# Altium schematic sheet aircraft.SchDoc
size A4
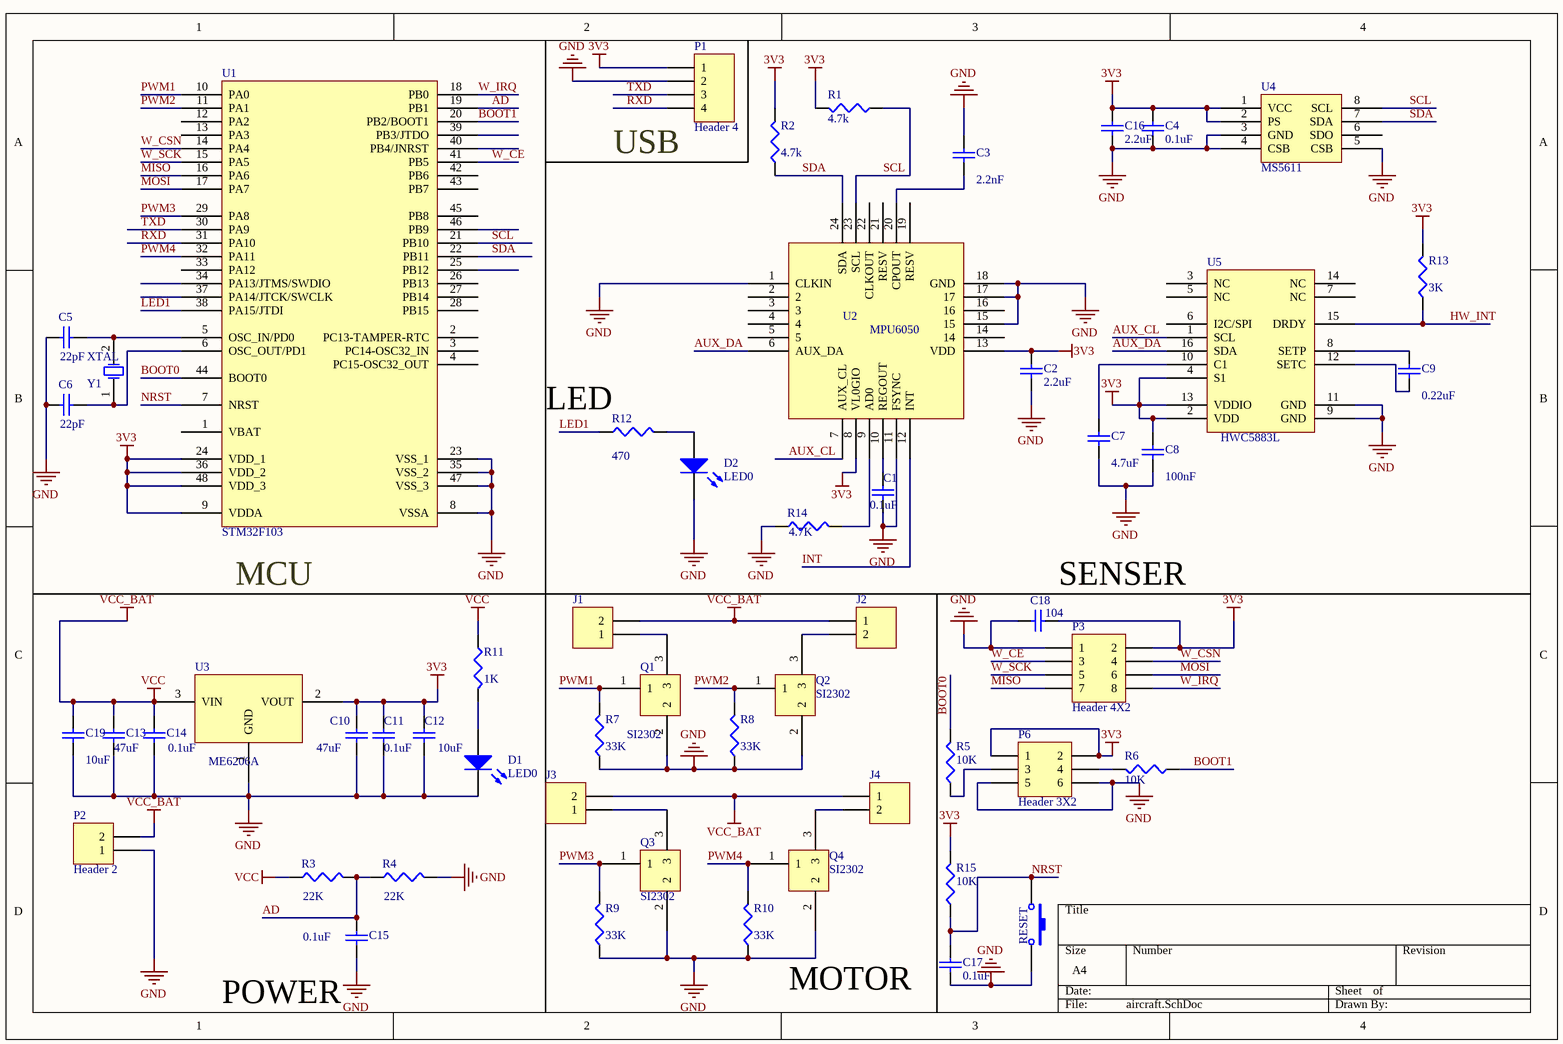
[diagram p0: aircraft.SchDoc]

## Parts
C1  value 0.1uF  [0402]  (hidden comment: Cap)
C2  value 2.2uF  [0402]  (hidden comment: Cap)
C3  value 2.2nF  [0402]  (hidden comment: Cap)
C4  value 0.1uF  [0402]  (hidden comment: Cap)
C5  value 22pF  [0402]  (hidden comment: Cap)
C6  value 22pF  [0402]  (hidden comment: Cap)
C7  value 4.7uF  [0402]  (hidden comment: Cap)
C8  value 100nF  [0402]  (hidden comment: Cap)
C9  value 0.22uF  [0402]  (hidden comment: Cap)
C10  value 47uF  [6-0805_L]  (hidden comment: Cap)
C11  value 0.1uF  [0402]  (hidden comment: Cap)
C12  value 10uF  [1608[0603]]  (hidden comment: Cap)
C13  value 47uF  [6-0805_L]  (hidden comment: Cap)
C14  value 0.1uF  [0402]  (hidden comment: Cap)
C15  value 0.1uF  [0402]  (hidden comment: Cap)
C16  value 2.2uF  [0402]  (hidden comment: Cap)
C17  value 0.1uF  [0402]  (hidden comment: Cap)
C18  value 104  [0402]  (hidden comment: Cap)
C19  value 10uF  [1608[0603]]  (hidden comment: Cap)
D1  LED0  [1608[0603]]
D2  LED0  [1608[0603]]
J1  Header 2  [HDR1X2]  (value not drawn)
J2  Header 2  [HDR1X2]  (value not drawn)
J3  Header 2  [HDR1X2]  (value not drawn)
J4  Header 2  [HDR1X2]  (value not drawn)
P1  Header 4  [HDR1X4]
P2  Header 2  [HDR1X2]
P3  Header 4X2  [HDR2X4]
P6  Header 3X2  [HDR2X3]
Q1  SI2302  [SOT-23_M]
Q2  SI2302  [SOT-23_M]
Q3  SI2302  [SOT-23_M]
Q4  SI2302  [SOT-23_M]
R1  value 4.7k  [0402]  (hidden comment: Res3)
R2  value 4.7k  [0402]  (hidden comment: Res3)
R3  value 22K  [0402]  (hidden comment: Res3)
R4  value 22K  [0402]  (hidden comment: Res3)
R5  value 10K  [0402]  (hidden comment: Res3)
R6  value 10K  [0402]  (hidden comment: Res3)
R7  value 33K  [0402]  (hidden comment: Res3)
R8  value 33K  [0402]  (hidden comment: Res3)
R9  value 33K  [0402]  (hidden comment: Res3)
R10  value 33K  [0402]  (hidden comment: Res3)
R11  value 1K  [0402]  (hidden comment: Res3)
R12  value 470  [0402]  (hidden comment: Res3)
R13  value 3K  [0402]  (hidden comment: Res3)
R14  value 4.7K  [0402]  (hidden comment: Res3)
R15  value 10K  [0402]  (hidden comment: Res3)
RESET  SW-PB  [SW2]  (value not drawn)
U1  STM32F103  [LQFP48S]
U2  MPU6050  [QFN24]
U3  ME6206A  [SOT23_M]
U4  MS5611  [MS5611 - duplicate]
U5  HWC5883L  [HMC5883L]
Y1  XTAL  [XTAL2]

## Nets
3V3: C2.2 C4.2 C8.2 C10.2 C11.1 C12.1 C16.2 C18.2 P1.1 P3.2 P6.1 P6.2 R1.2 R2.2 R13.2 R15.2 U1.9(VDDA) U1.24(VDD_1) U1.36(VDD_2) U1.48(VDD_3) U2.8(VL0GIO) U2.13(VDD) U3.2(VOUT) U4.1(VCC) U4.2(PS) U5.2(VDD) U5.4(S1) U5.13(VDDIO)
GND: C1.1 C2.1 C3.2 C4.1 C5.1 C6.1 C7.1 C8.1 C10.1 C11.2 C12.2 C13.1 C14.1 C15.1 C16.1 C17.2 C18.1 C19.1 D1.2(K) D2.2(K) P1.2 P2.1 P3.1 P6.5 P6.6 Q1.2 Q2.2 Q3.2 Q4.2 R4.2 R7.1 R8.1 R9.1 R10.1 R14.1 RESET.2 U1.8(VSSA) U1.23(VSS_1) U1.35(VSS_2) U1.47(VSS_3) U2.1(CLKIN) U2.11(FSYNC) U2.15 U2.17 U2.18(GND) U3.1(GND) U4.3(GND) U4.4(CSB) U4.5(CSB) U5.9(GND) U5.11(GND)
VCC: C13.2 C14.2 C19.2 J1.2 J2.1 J3.2 J4.1 P2.2 R3.1 R11.1 U3.3(VIN)  [also labelled VCC_BAT]
AD: C15.2 R3.2 R4.1 U1.19(PB1)
AUX_CL: U2.7(AUX_CL) U5.1(SCL)
AUX_DA: U2.6(AUX_DA) U5.16(SDA)
BOOT0: R5.2 U1.44(BOOT0)
BOOT1: R6.1 U1.20(PB2/BOOT1)
HW_INT: R13.1 U5.15(DRDY)
INT: U2.12(INT)
LED1: R12.1 U1.38(PA15/JTDI)
MISO: P3.7 U1.16(PA6)
MOSI: P3.6 U1.17(PA7)
NRST: C17.1 R15.1 RESET.1 U1.7(NRST)
PWM1: Q1.1 R7.2 U1.10(PA0)
PWM2: Q2.1 R8.2 U1.11(PA1)
PWM3: Q3.1 R9.2 U1.29(PA8)
PWM4: Q4.1 R10.2 U1.32(PA11)
RXD: P1.4 U1.31(PA10)
SCL: R1.1 U1.21(PB10) U2.23(SCL) U4.8(SCL)
SDA: R2.1 U1.22(PB11) U2.24(SDA) U4.7(SDA)
TXD: P1.3 U1.30(PA9)
W_CE: P3.3 U1.41(PB5)
W_CSN: P3.4 U1.14(PA4)
W_IRQ: P3.8 U1.18(PB0)
W_SCK: P3.5 U1.15(PA5)
NetC1_2: C1.2 U2.10(REGOUT)
NetC3_1: C3.1 U2.20(CPOUT)
NetC5_2: C5.2 U1.5(OSC_IN/PD0) Y1.2(OSC2)
NetC6_2: C6.2 U1.6(OSC_OUT/PD1) Y1.1(OSC1)
NetC7_2: C7.2 U5.10(C1)
NetC9_1: C9.1 U5.12(SETC)
NetC9_2: C9.2 U5.8(SETP)
NetD1_1: D1.1(A) R11.2
NetD2_1: D2.1(A) R12.2
NetJ1_1: J1.1 Q1.3
NetJ2_2: J2.2 Q2.3
NetJ3_1: J3.1 Q3.3
NetJ4_2: J4.2 Q4.3
NetP6_3: P6.3 R5.1
NetP6_4: P6.4 R6.2
NetR14_2: R14.2 U2.9(AD0)

Not connected (* = marked no-connect by the designer): U1 1(VBAT) 2(PC13-TAMPER-RTC) 3(PC14-OSC32_IN) 4(PC15-OSC32_OUT) 12(PA2) 13(PA3) 25(PB12) 26(PB13) 27(PB14) 28(PB15) 33(PA12) 34(PA13/JTMS/SWDIO) 37(PA14/JTCK/SWCLK) 39(PB3/JTDO) 40(PB4/JNRST) 42(PB6) 43(PB7) 45(PB8) 46(PB9); U2 2 3 4 5 14 16 19(RESV) 21(RESV) 22(CLKOUT); U4 6(SDO); U5 3(NC) 5(NC) 6(I2C/SPI) 7(NC) 14(NC)

## Notes on the sheet
- (near P1) USB
- (near R12) LED
- (near U1) MCU
- (near C18) SENSER
- (near R10) MOTOR
- POWER

## Library data of the parts
C1-C19 = Cap: Capacitor; Published: 8-Jun-2000; LatestRevisionDate: 17-Jul-2002; LatestRevisionNote: Re-released for DXP Platform.; PackageReference: RAD-0.3; Publisher: Altium Limited; PackageDescription: Radial Cap, Thru-Hole; 2 Leads; 0.3 in Pin Spacing
D1 D2 = LED0: Typical INFRARED GaAs LED; Published: 8-Jun-2000; LatestRevisionDate: 08-Jul-2005; LatestRevisionNote: Mech Layer 1 removed.; PackageReference: LED-0; Publisher: Altium Limited; PackageDescription: LED; 2 Leads
J1-J4 P2 = Header 2: Header, 2-Pin; LatestRevisionDate: 17-Jul-2002; LatestRevisionNote: Re-released for DXP Platform.; Publisher: Altium Limited
P1 = Header 4: Header, 4-Pin; LatestRevisionDate: 17-Jul-2002; LatestRevisionNote: Re-released for DXP Platform.; Publisher: Altium Limited
P3 = Header 4X2: Header, 4-Pin, Dual row; LatestRevisionDate: 17-Jul-2002; LatestRevisionNote: Re-released for DXP Platform.; Publisher: Altium Limited
P6 = Header 3X2: Header, 3-Pin, Dual row; LatestRevisionDate: 17-Jul-2002; LatestRevisionNote: Re-released for DXP Platform.; Publisher: Altium Limited
R1-R15 = Res3: Resistor; Published: 8-Jun-2000; LatestRevisionDate: 29-May-2009; LatestRevisionNote: IPC-7351 Footprint Added.; PackageReference: J1-0603; Publisher: Altium Limited; PackageDescription: Chip Resistor
RESET = SW-PB: Switch; Published: 24-Mar-1999; LatestRevisionDate: 17-Jul-2002; LatestRevisionNote: Re-released for DXP Platform.; PackageReference: SPST-2; Publisher: Altium Limited; PackageDescription: Switch; 2 Leads
U5 = HMC5883L
Y1 = XTAL: Crystal Oscillator; Published: 8-Jun-2000; LatestRevisionDate: 17-Jul-2002; LatestRevisionNote: Re-released for DXP Platform.; PackageReference: R38; Publisher: Altium Limited; PackageDescription: Crystal, Thru-Hole; 2 Leads; Body 3.1 x 8.2 mm (Dia.xH)